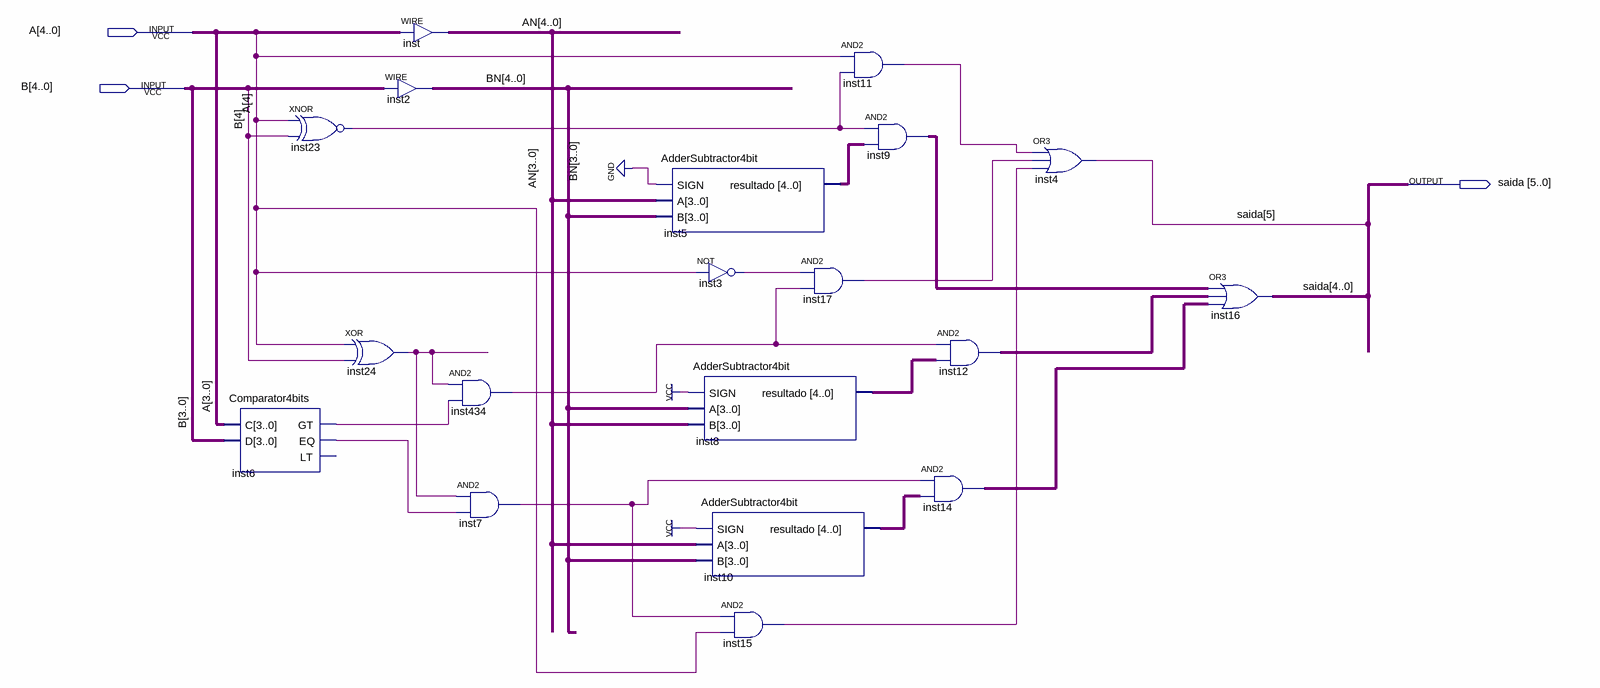
[diagram p0: schematic sheet]
// Quartus schematic SomaOP2.bdf as structural Verilog: 19 symbols, 3 pins
module SomaOP2 (
  input  [4:0] A,
  input  [4:0] B,
  output [5:0] saida
);

  wire inst3_out, inst6_eq, inst6_gt, inst7_out, inst11_out, inst15_out, inst17_out, inst23_out, inst24_out,
       inst434_out;
  wire [4:0] AN, BN, inst5_resultado, inst8_resultado, inst9_out, inst10_resultado, inst12_out, inst14_out;

  Comparator4bits inst6 (.C(A[3:0]), .D(B[3:0]), .GT(inst6_gt), .EQ(inst6_eq));  // open: LT
  xnor inst23 (inst23_out, A[4], B[4]);
  assign AN = A;  // WIRE inst
  assign BN = B;  // WIRE inst2
  xor inst24 (inst24_out, A[4], B[4]);
  and inst434 (inst434_out, inst24_out, inst6_gt);
  and inst7 (inst7_out, inst24_out, inst6_eq);
  AdderSubtractor4bit inst5 (.SIGN(1'b0), .A(AN[3:0]), .B(BN[3:0]), .resultado(inst5_resultado));
  not inst3 (inst3_out, A[4]);
  AdderSubtractor4bit inst8 (.SIGN(1'b1), .A(BN[3:0]), .B(AN[3:0]), .resultado(inst8_resultado));
  AdderSubtractor4bit inst10 (.SIGN(1'b1), .A(AN[3:0]), .B(BN[3:0]), .resultado(inst10_resultado));
  and inst15 (inst15_out, inst7_out, A[4]);
  and inst11 (inst11_out, A[4], inst23_out);
  and inst17 (inst17_out, inst3_out, inst434_out);
  assign inst9_out = {5{inst23_out}} & inst5_resultado;  // AND2 inst9, 5 bits wide
  assign inst12_out = {5{inst434_out}} & inst8_resultado;  // AND2 inst12, 5 bits wide
  assign inst14_out = {5{inst7_out}} & inst10_resultado;  // AND2 inst14, 5 bits wide
  or inst4 (saida[5], inst11_out, inst17_out, inst15_out);
  assign saida[4:0] = inst9_out | inst12_out | inst14_out;  // OR3 inst16, 5 bits wide
endmodule
